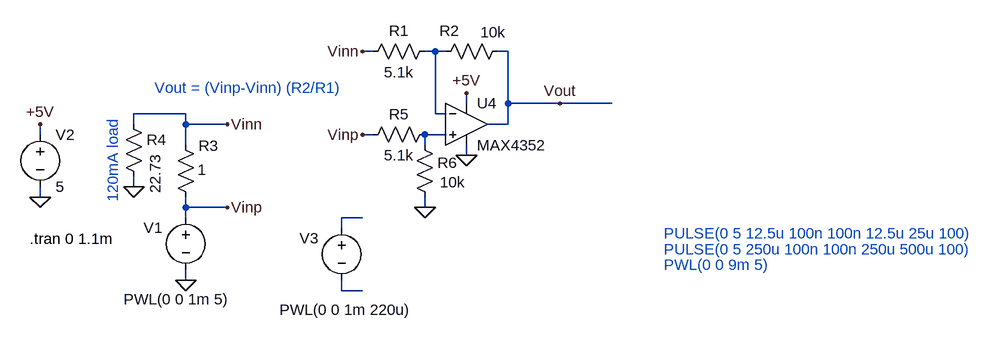
[diagram p0: schematic current-sns-amp.asc]
current-sns-amp.asc, the LTspice schematic file:
Version 4
SHEET 1 880 680
WIRE -80 0 -96 0
WIRE 16 0 0 0
WIRE 32 0 16 0
WIRE 128 0 112 0
WIRE 64 80 64 64
WIRE 128 80 128 0
WIRE 208 80 128 80
WIRE 288 80 208 80
WIRE -368 96 -448 96
WIRE 16 96 16 0
WIRE 32 96 16 96
WIRE -448 112 -448 96
WIRE -368 112 -368 96
WIRE -304 112 -368 112
WIRE 128 112 128 80
WIRE 128 112 96 112
WIRE -592 128 -592 112
WIRE -80 128 -96 128
WIRE 32 128 0 128
WIRE -368 144 -368 112
WIRE 0 144 0 128
WIRE 64 160 64 144
WIRE -448 208 -448 192
WIRE -592 224 -592 208
WIRE -368 240 -368 224
WIRE -304 240 -368 240
WIRE 0 240 0 224
WIRE -368 256 -368 240
WIRE -96 256 -128 256
WIRE -128 272 -128 256
WIRE -368 352 -368 336
WIRE -128 368 -128 352
WIRE -96 368 -128 368
FLAG -592 224 0
FLAG -592 112 +5V
FLAG 64 64 +5V
FLAG 64 160 0
FLAG -368 352 0
FLAG -304 240 Vinp
FLAG 208 80 Vout
FLAG -448 208 0
FLAG -304 112 Vinn
FLAG 0 240 0
FLAG -96 128 Vinp
FLAG -96 0 Vinn
SYMBOL res -384 128 R0
WINDOW 0 36 17 Left 2
WINDOW 3 34 54 Left 2
SYMATTR InstName R3
SYMATTR Value 1
SYMBOL voltage -368 240 R0
WINDOW 0 -65 31 Left 2
WINDOW 3 -96 141 Left 2
WINDOW 123 0 0 Left 0
WINDOW 39 0 0 Left 0
SYMATTR InstName V1
SYMATTR Value PWL(0 0 1m 5)
SYMBOL voltage -592 112 R0
SYMATTR InstName V2
SYMATTR Value 5
SYMBOL res 16 -16 R90
WINDOW 0 0 56 VBottom 2
WINDOW 3 32 56 VTop 2
SYMATTR InstName R1
SYMATTR Value 5.1k
SYMBOL res 128 -16 R90
WINDOW 0 0 90 VBottom 2
WINDOW 3 -29 23 VTop 2
SYMATTR InstName R2
SYMATTR Value 10k
SYMBOL res -464 96 R0
WINDOW 3 49 62 VRight 2
SYMATTR Value 22.73
SYMATTR InstName R4
SYMBOL res 16 112 R90
WINDOW 0 0 56 VBottom 2
WINDOW 3 32 56 VTop 2
SYMATTR InstName R5
SYMATTR Value 5.1k
SYMBOL res 16 240 R180
WINDOW 0 -34 69 Left 2
WINDOW 3 -46 39 Left 2
SYMATTR InstName R6
SYMATTR Value 10k
SYMBOL Opamps\\MAX4352 64 48 R0
SYMATTR InstName U4
SYMBOL voltage -128 256 R0
WINDOW 0 -65 31 Left 2
WINDOW 3 -96 141 Left 2
WINDOW 123 0 0 Left 0
WINDOW 39 0 0 Left 0
SYMATTR InstName V3
SYMATTR Value PWL(0 0 1m 220u)
TEXT -416 56 Left 2 ;Vout = (Vinp-Vinn) (R2/R1)
TEXT -608 288 Left 2 !.tran 0 1.1m
TEXT 368 280 Left 2 ;PULSE(0 5 12.5u 100n 100n 12.5u 25u 100)
TEXT 368 304 Left 2 ;PULSE(0 5 250u 100n 100n 250u 500u 100)
TEXT 368 328 Left 2 ;PWL(0 0 9m 5)
TEXT -480 232 VLeft 2 ;120mA load

The netlist it stands for:
* current-sns-amp.asc
R3 Vinn Vinp 1
V1 Vinp 0 PWL(0 0 1m 5)
V2 +5V 0 5
R1 N001 Vinn 5.1k
R2 Vout N001 10k
R4 Vinn 0 22.73
R5 N002 Vinp 5.1k
R6 0 N002 10k
XU4 N002 N001 +5V 0 Vout MAX4352  ; pins In+ In- V+ V- OUT
V3 N003 N004 PWL(0 0 1m 220u)
* Vout = (Vinp-Vinn) (R2/R1)
.tran 0 1.1m
* PULSE(0 5 12.5u 100n 100n 12.5u 25u 100)
* PULSE(0 5 250u 100n 100n 250u 500u 100)
* PWL(0 0 9m 5)
* 120mA load
.backanno
.end